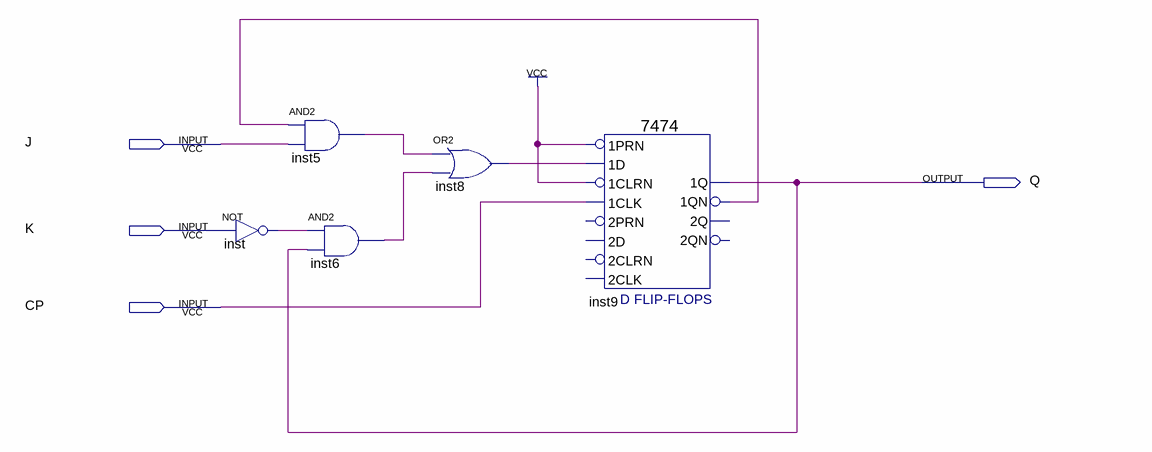
[diagram p0: schematic sheet]
// Quartus schematic Experiment5.bdf as structural Verilog: 5 symbols, 4 pins
module Experiment5 (
  input  J,
  input  K,
  input  CP,
  output Q
);

  wire inst5_out, inst6_out, inst8_out, inst9_1qn, inst_out;

  not inst (inst_out, K);
  and inst5 (inst5_out, inst9_1qn, J);
  and inst6 (inst6_out, inst_out, Q);
  or inst8 (inst8_out, inst5_out, inst6_out);
  \7474  inst9 (
    .\1CLK (CP), .\1D (inst8_out), .\1PRN (1'b1), .\1CLRN (1'b1), .\1QN (inst9_1qn), .\1Q (Q));  // open: 2D, 2PRN, 2CLK, 2CLRN, 2Q, 2QN
endmodule
